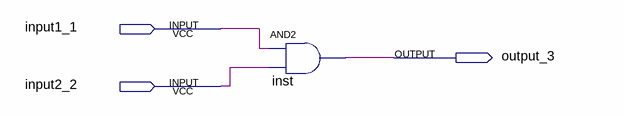
[diagram p0: schematic sheet]
// Quartus schematic my_and2.bdf as structural Verilog: 1 symbols, 3 pins
module my_and2 (
  input  input1_1,
  input  input2_2,
  output output_3
);

  and inst (output_3, input1_1, input2_2);
endmodule
